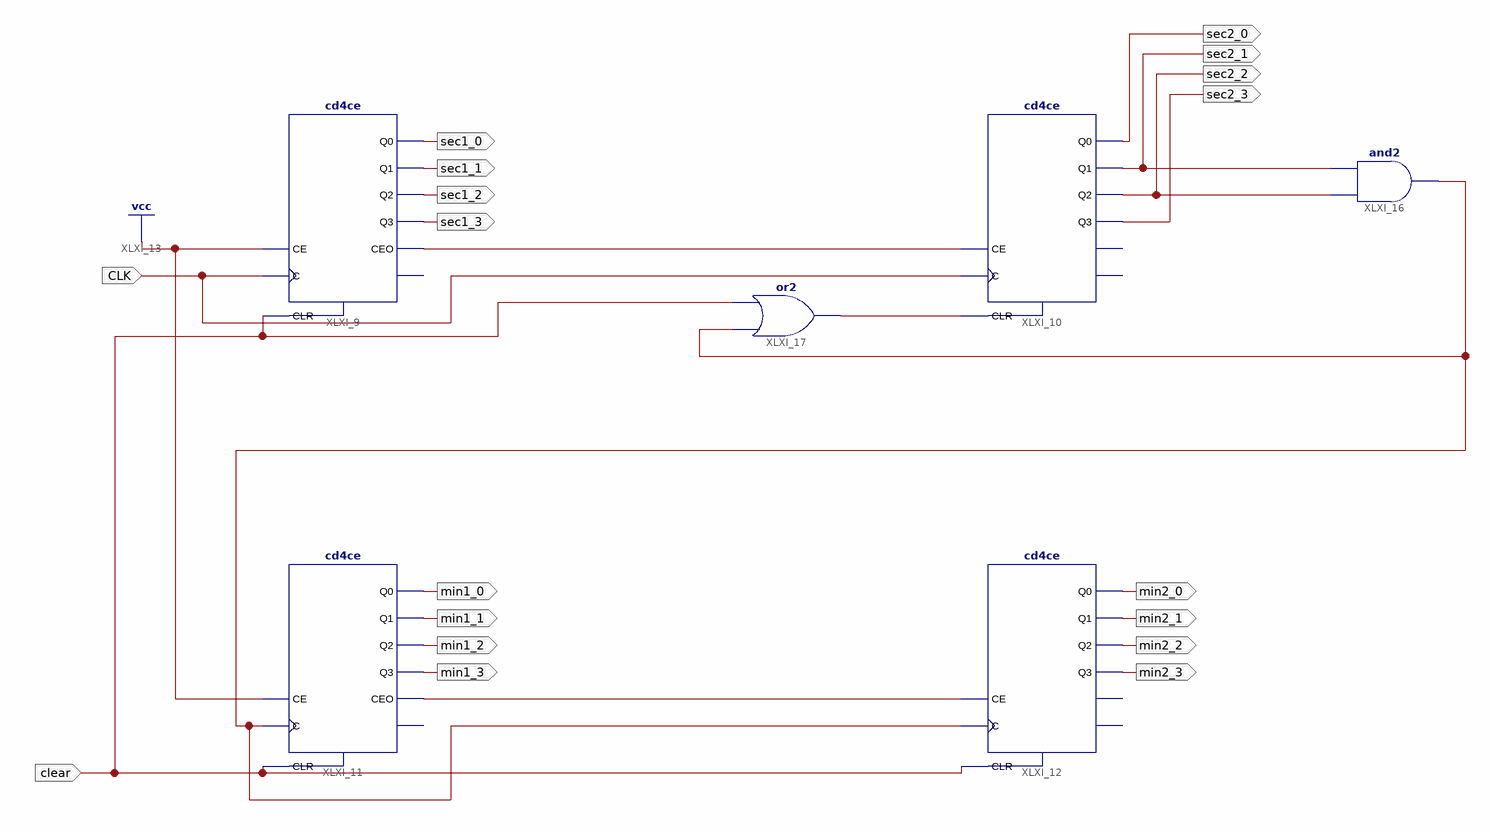
[diagram p0: schematic sheet 1]
// Xilinx ISE schematic counter.sch (spartan6) as structural Verilog: 6 symbols, 18 ports
module counter (
  input  CLK,
  input  clear,
  output sec2_0,
  output sec2_1,
  output sec2_2,
  output sec2_3,
  output sec1_0,
  output sec1_1,
  output sec1_2,
  output sec1_3,
  output min1_0,
  output min1_1,
  output min1_2,
  output min1_3,
  output min2_0,
  output min2_1,
  output min2_2,
  output min2_3
);

  wire XLXN_57, XLXN_58, XLXN_62, XLXN_64;

  cd4ce XLXI_9 (
    .C(CLK), .CE(1'b1), .CLR(clear), .CEO(XLXN_62), .Q0(sec1_0), .Q1(sec1_1), .Q2(sec1_2), .Q3(sec1_3));  // open: TC
  cd4ce XLXI_10 (
    .C(CLK), .CE(XLXN_62), .CLR(XLXN_58), .Q0(sec2_0), .Q1(sec2_1), .Q2(sec2_2), .Q3(sec2_3));  // open: CEO, TC
  cd4ce XLXI_11 (
    .C(XLXN_57), .CE(1'b1), .CLR(clear), .CEO(XLXN_64), .Q0(min1_0), .Q1(min1_1), .Q2(min1_2), .Q3(min1_3));  // open: TC
  cd4ce XLXI_12 (
    .C(XLXN_57), .CE(XLXN_64), .CLR(clear), .Q0(min2_0), .Q1(min2_1), .Q2(min2_2), .Q3(min2_3));  // open: CEO, TC
  and XLXI_16 (XLXN_57, sec2_2, sec2_1);
  or XLXI_17 (XLXN_58, XLXN_57, clear);
endmodule
